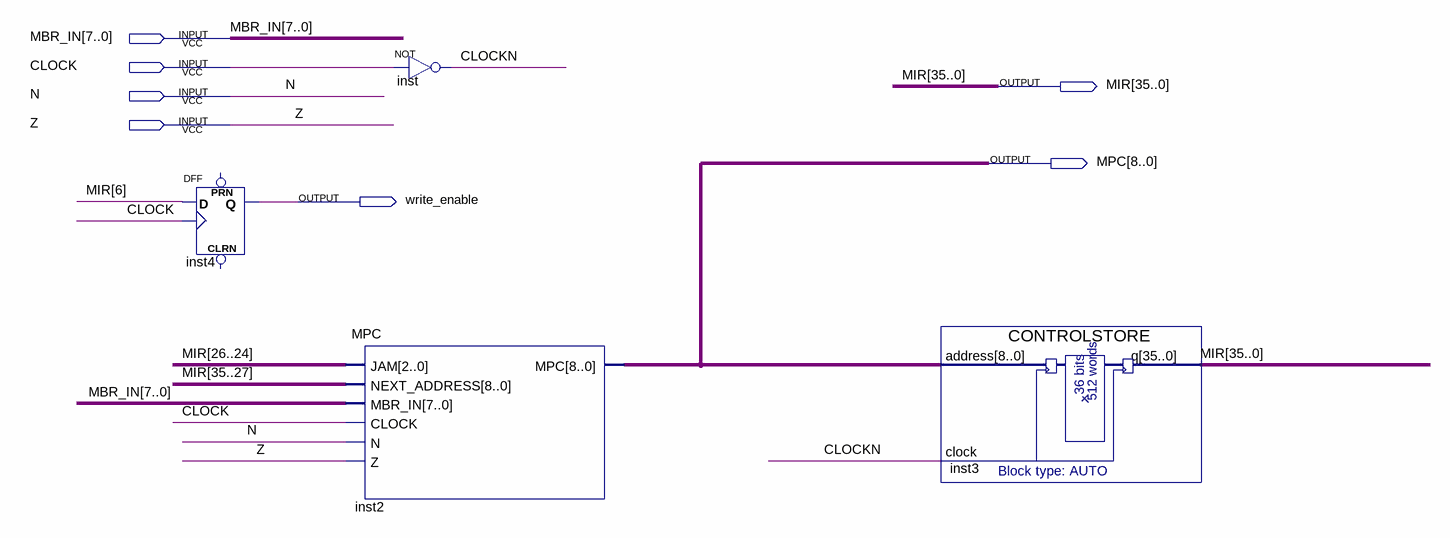
[diagram p0: schematic sheet]
// Quartus schematic UNIDADE_CONTROLE.bdf as structural Verilog: 4 symbols, 7 pins
module UNIDADE_CONTROLE (
  input  [7:0] MBR_IN,
  input  CLOCK,
  input  N,
  input  Z,
  output [35:0] MIR,
  output [8:0] MPC,
  output write_enable
);

  wire CLOCKN;

  DFF inst4 (.CLK(CLOCK), .D(MIR[6]), .Q(write_enable));  // open: CLRN, PRN
  not inst (CLOCKN, CLOCK);
  MPC inst2 (.JAM(MIR[26:24]), .NEXT_ADDRESS(MIR[35:27]), .MBR_IN(MBR_IN), .CLOCK(CLOCK), .N(N), .Z(Z), .MPC(MPC));
  CONTROLSTORE inst3 (.address(MPC), .clock(CLOCKN), .q(MIR));
endmodule
